# EAGLE design RJ45-LED-Breakout (EAGLE 6.6.0)
CNAME: RJ45 LED Breakout; CREVISION: 1.0; DESIGNER: Logan Smith
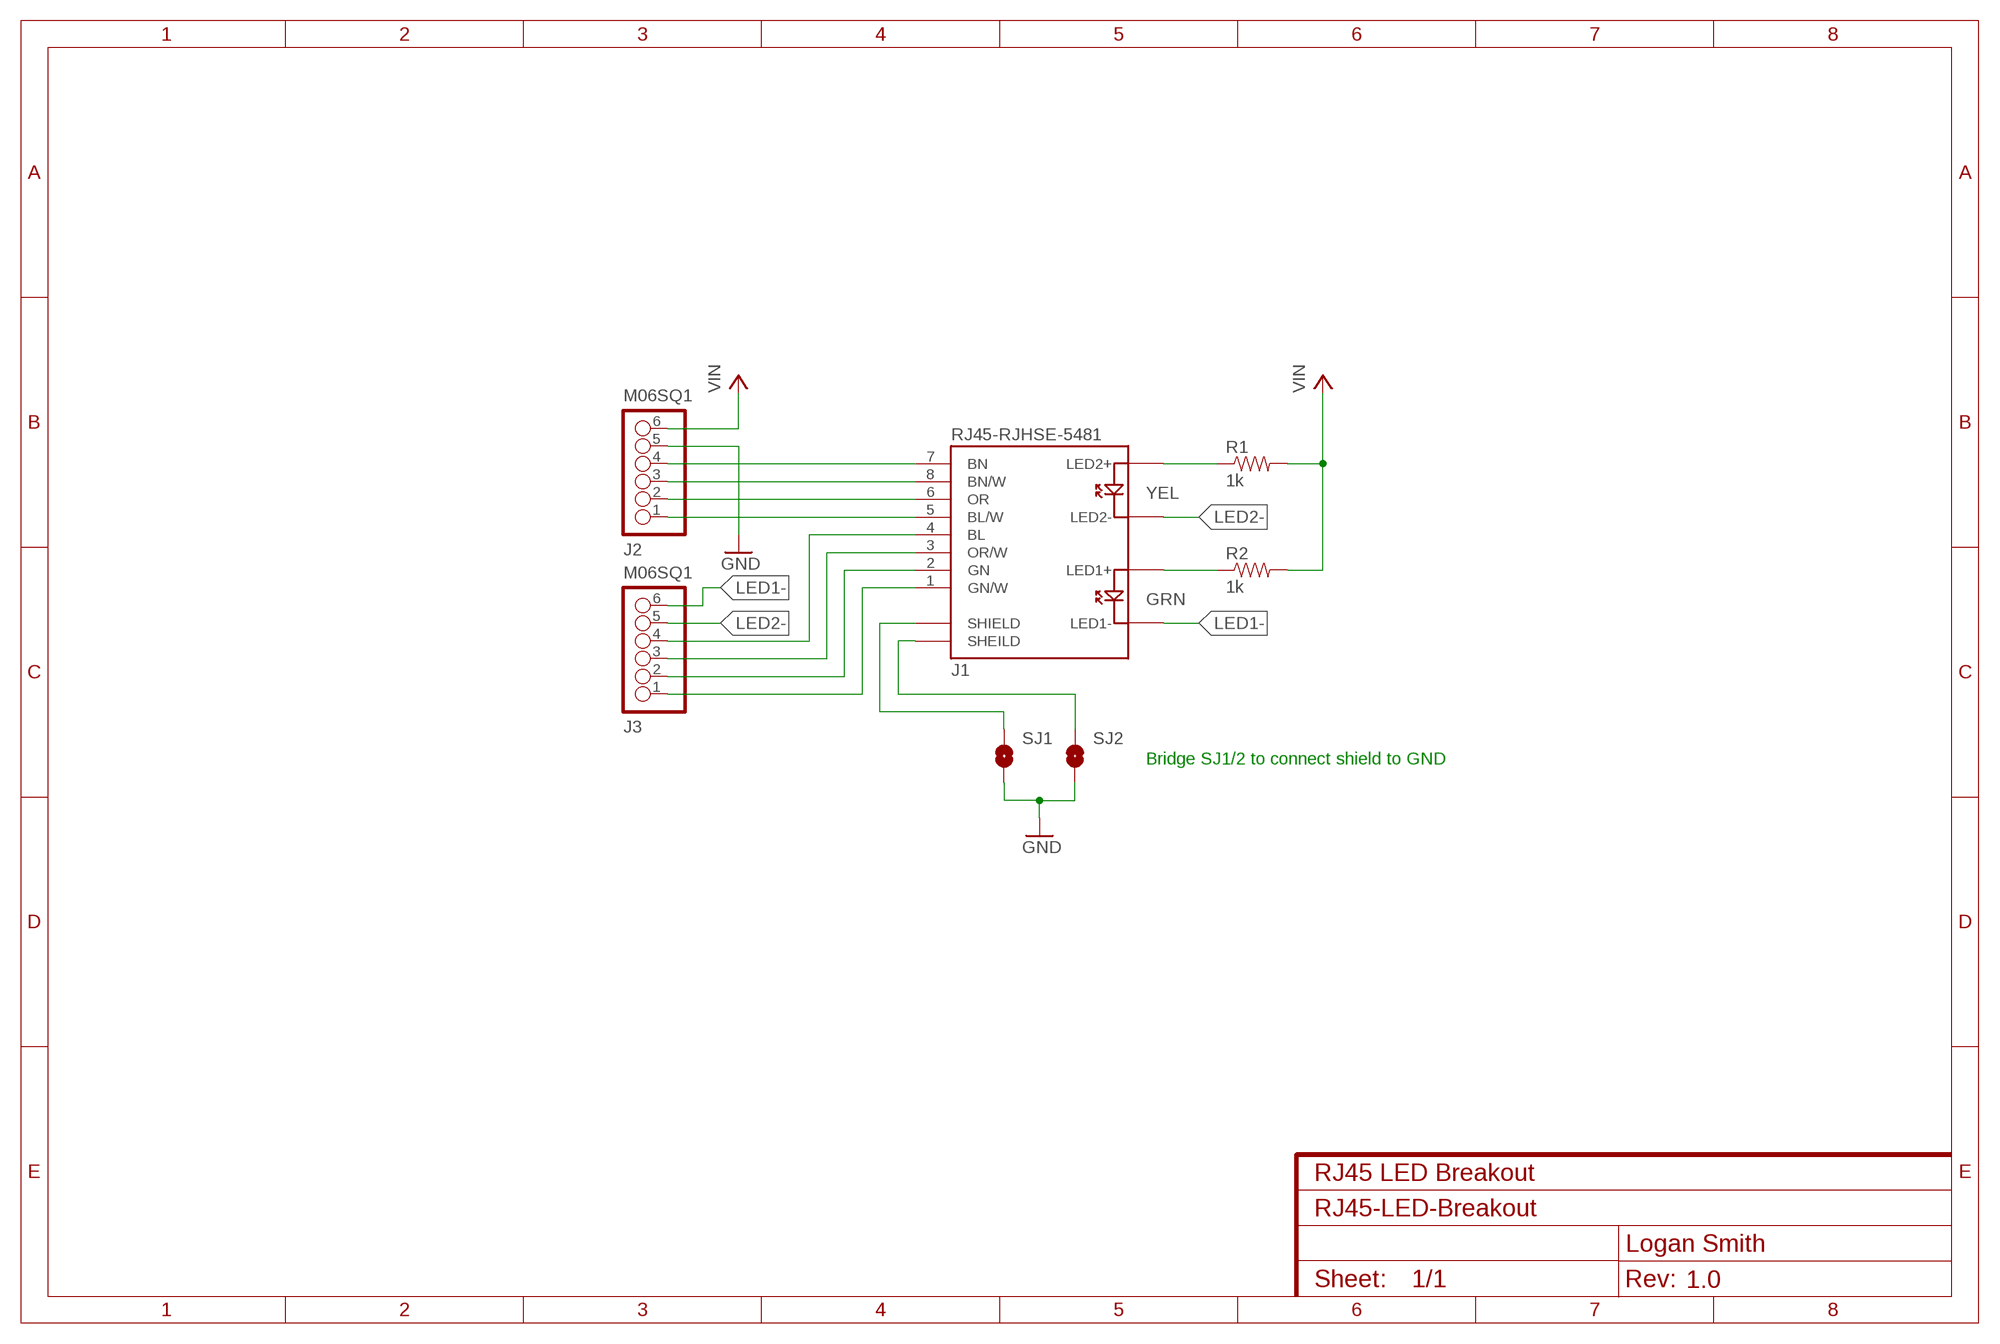
[diagram p0: schematic, sheet 1]

## Parts
J1  RJ45-RJHSE-5481  [RJ45-RJHSE]
J2  M06SQ1  [1X06_SQ1]
J3  M06SQ1  [1X06_SQ1]
R1  1k  1K-5%-0805  [0805-RES]
R2  1k  1K-5%-0805  [0805-RES]
SJ1  SJ_1WAY  [SJ_2]
SJ2  SJ_1WAY  [SJ_2]

## Nets
GND: J2.5 SJ1.2 SJ2.2
LED1+: J1.LED1+ R2.P$1
LED1-: J1.LE1D-(LED1-) J3.6
LED2+: J1.LED2+ R1.P$1
LED2-: J1.LED2- J3.5
N$1: J1.5(BL/W) J2.1
N$2: J1.6(OR) J2.2
N$3: J1.8(BN/W) J2.3
N$4: J1.7(BN) J2.4
N$5: J1.4(BL) J3.4
N$6: J1.3(OR/W) J3.3
N$7: J1.2(GN) J3.2
N$8: J1.1(GN/W) J3.1
N$11: J1.SHIELD@0(SHIELD) SJ1.1
N$12: J1.SHEILD@1(SHEILD) SJ2.1
VIN: J2.6 R1.P$2 R2.P$2

## Notes on the sheet
- Bridge SJ1/2 to connect shield to GND

## Library data of the parts
J1 = LoganSmith-Connectors:RJ45-RJHSE-548*: Shielded CAT5 RJ45 90° w/ LEDs and board lock Datasheet <https://www.amphenolcanada.com/ProductSearch/drawings/AC/RJHSE548X.pdf>; LED1_COLOR: GRN; LED2_COLOR: YEL
J2 J3 = LoganSmith-Connectors:M06?: 1x6 Headers
R1 R2 = LoganSmith-Resistors:1K-*-?: 10k Resistor, Panasonic; DIGIKEY_OC: P1.0KACT-ND; MFR: Panasonic Electronic Components; MPN: ERJ-6GEYJ102V; POWER: 0.125W
SJ1 SJ2 = LoganSmith-Connectors:SJ_1WAY: 1-way solder jumper

## Board
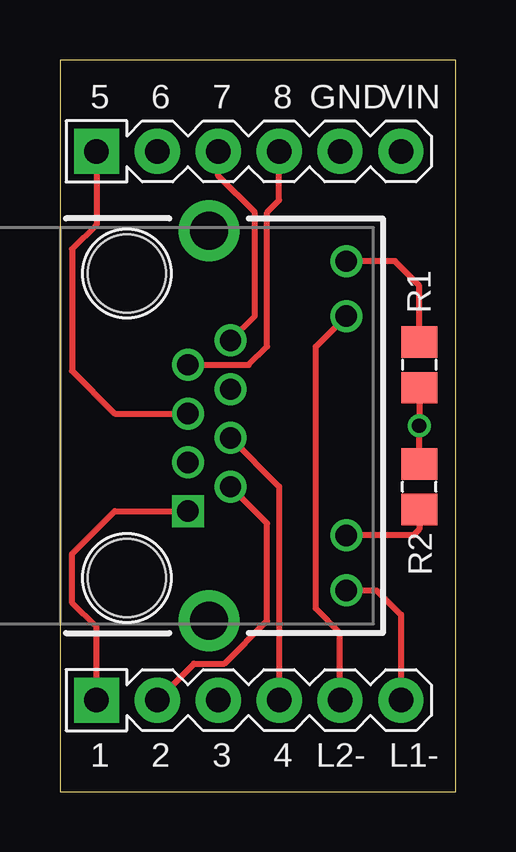
[diagram p1: board, top side]
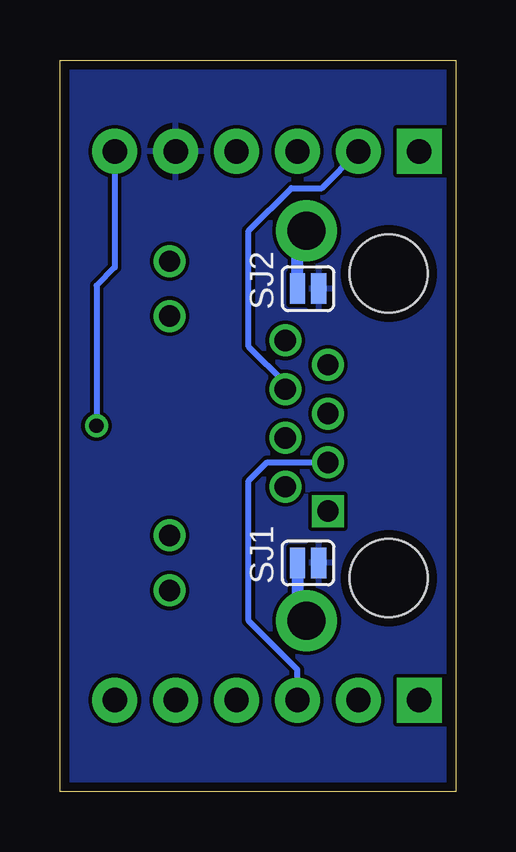
[diagram p2: board, bottom side, seen from below]

Size 16.51 x 30.48 mm. Coordinates in mm from the lower left corner, seen from the top.
Outline: 0,0 16.51,0 16.51,30.48 0,30.48 0,0
Copper layers (1*16): Top 0.0356mm / dielectric 1.5011mm / Bottom 0.0356mm
Design rules "OSHPark": minimum track width 6mil, minimum drill 13mil, track to track 6mil, track to pad 6mil, pad to pad 6mil, via to via 6mil, smd to smd 6mil, copper to edge 15mil, drill to drill 6mil, minimum pad ring 7mil, minimum via ring 7mil, stop-mask expansion 3mil, vias tented up to drill 0mil, thermal gap 10mil

### Footprints (pad centres in the part's own frame; a part is rotated, then mirrored left to right if it is on the bottom)
RJ45-RJHSE = drill 0.889 square: 1 3.556,-1.778 | drill 0.889: 2 2.54,0; 3 1.524,-1.778; 4 0.508,0; 5 -0.508,-1.778; 6 -1.524,0; 7 -2.54,-1.778; 8 -3.556,0; LE1D- 6.858,4.826; LED1+ 4.572,4.826; LED2+ -6.858,4.826; LED2- -4.572,4.826 | drill 1.575 pad 2.54: SHEILD@1 -8.128,-0.889; SHIELD@0 8.128,-0.889 | hole 3.25: -6.35,-4.318; 6.35,-4.318
1X06_SQ1 = drill 1.016 pad 1.88 square: 1 0,0 | drill 1.016 pad 1.88: 2 2.54,0; 3 5.08,0; 4 7.62,0; 5 10.16,0; 6 12.7,0
0805-RES = smd 1.3 x 1.5: P$1 -0.95,0; P$2 0.95,0
SJ_2 = smd 0.635 x 1.27: 1 -0.889,0; 2 0,0

### Placement (x,y rotation side)
J1  7.11,15.24 270 top
J2  1.52,26.67 0 top
J3  1.52,3.81 0 top
R1  14.99,17.78 270 top
R2  14.99,12.7 90 top
SJ1  5.71,9.53 0 bottom
SJ2  5.71,20.95 0 bottom

### Tracks (layer width: path | path; a pad name or v marks a point on that pad's centre or on a via)
GND
  pour Bottom: 0,30.48 16.51,30.48 16.51,0 0,0
LED1+
  Top 0.254: R2.P$1 14.99,10.92 14.73,10.67 J1.LED1+
LED1-
  Top 0.254: J1.LE1D- 13.21,8.38 14.22,7.37 J3.6
LED2+
  Top 0.254: R1.P$1 14.99,21.08 13.97,22.1 J1.LED2+
LED2-
  Top 0.254: J3.5 11.68,6.6 10.67,7.62 10.67,18.54 J1.LED2-
N$1
  Top 0.254: J2.1 1.52,23.62 0.51,22.61 0.51,17.53 2.29,15.75 J1.5
N$2
  Bottom 0.254: J1.6 7.11,17.02 8.64,18.54 8.64,23.37 6.86,25.15 5.59,25.15 J2.2
N$3
  Top 0.254: J1.8 8.13,19.81 8.13,24.13 6.6,25.65 J2.3
N$4
  Top 0.254: J1.7 7.87,17.78 8.64,18.54 8.64,24.13 9.14,24.64 J2.4
N$5
  Top 0.254: J1.4 9.14,12.7 J3.4
N$6
  Bottom 0.254: J3.3 6.6,5.08 8.64,7.11 8.64,12.95 7.87,13.72 J1.3
N$7
  Top 0.254: J3.2 5.59,5.33 6.86,5.33 8.64,7.11 8.64,11.18 J1.2
N$8
  Top 0.254: J3.1 1.52,6.86 0.51,7.87 0.51,9.91 2.29,11.68 J1.1
N$11
  Bottom 0.508: SJ1.1 6.6,7.49 J1.SHIELD@0
N$12
  Bottom 0.508: SJ2.1 6.6,22.99 J1.SHEILD@1
VIN  (via drill 0.6)
  Top 0.254: R1.P$2 v14.99,15.24 R2.P$2
  Bottom 0.254: J2.6 14.22,21.84 14.99,21.08 v14.99,15.24

### Text on the board
tPlace: 5 | 6 | 7 | 8 | GND | VIN | 1 | 2 | 3 | 4 | L2- | L1-